# Altium schematic sheet 02_POWERDIAGRAM-WITHOUT_BATTERY.SchDoc: P30L
size A1; Author: Kang jin; Engineer: Kang jin; Organization: 六零加智能科技; Address4: www.nidone.com.cn; Revision: 1.0; SheetNumber: 2; SheetTotal: 23
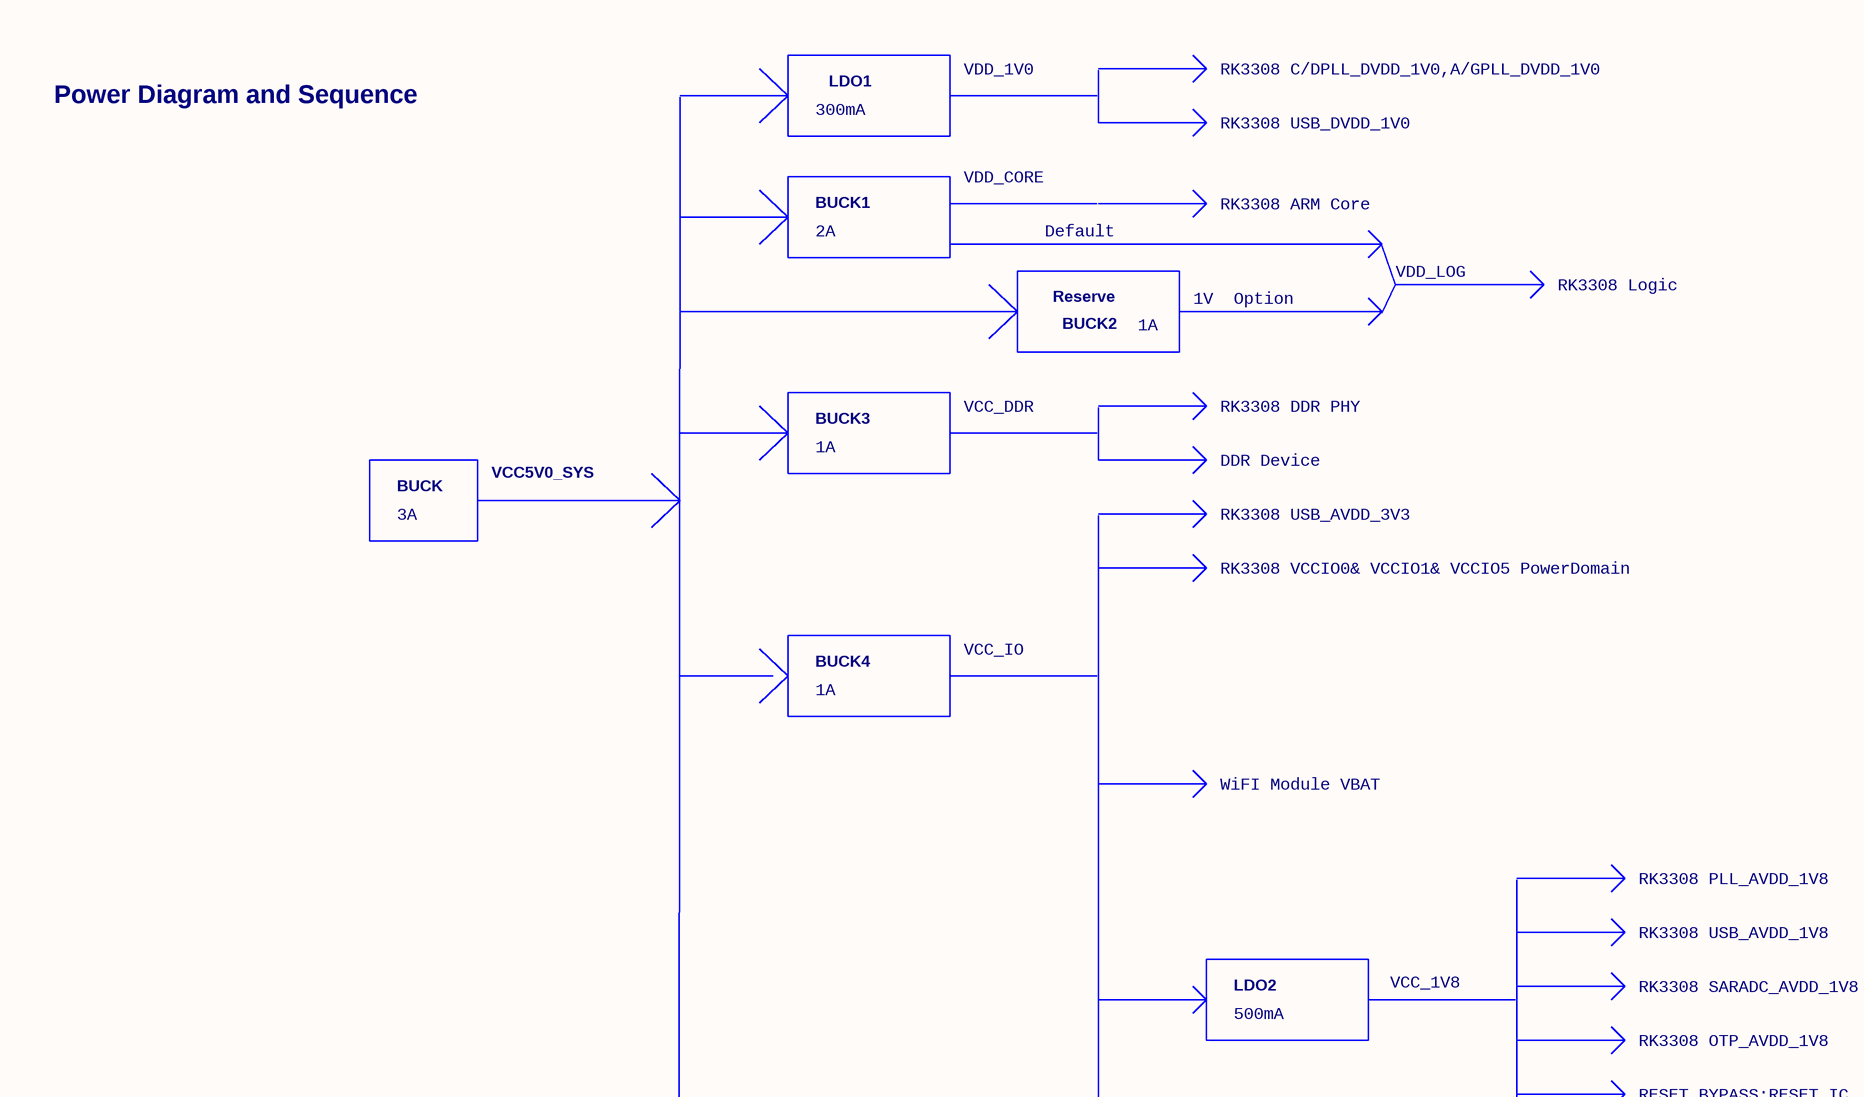
[diagram p0: 02_POWERDIAGRAM-WITHOUT_BATTERY.SchDoc, top left]
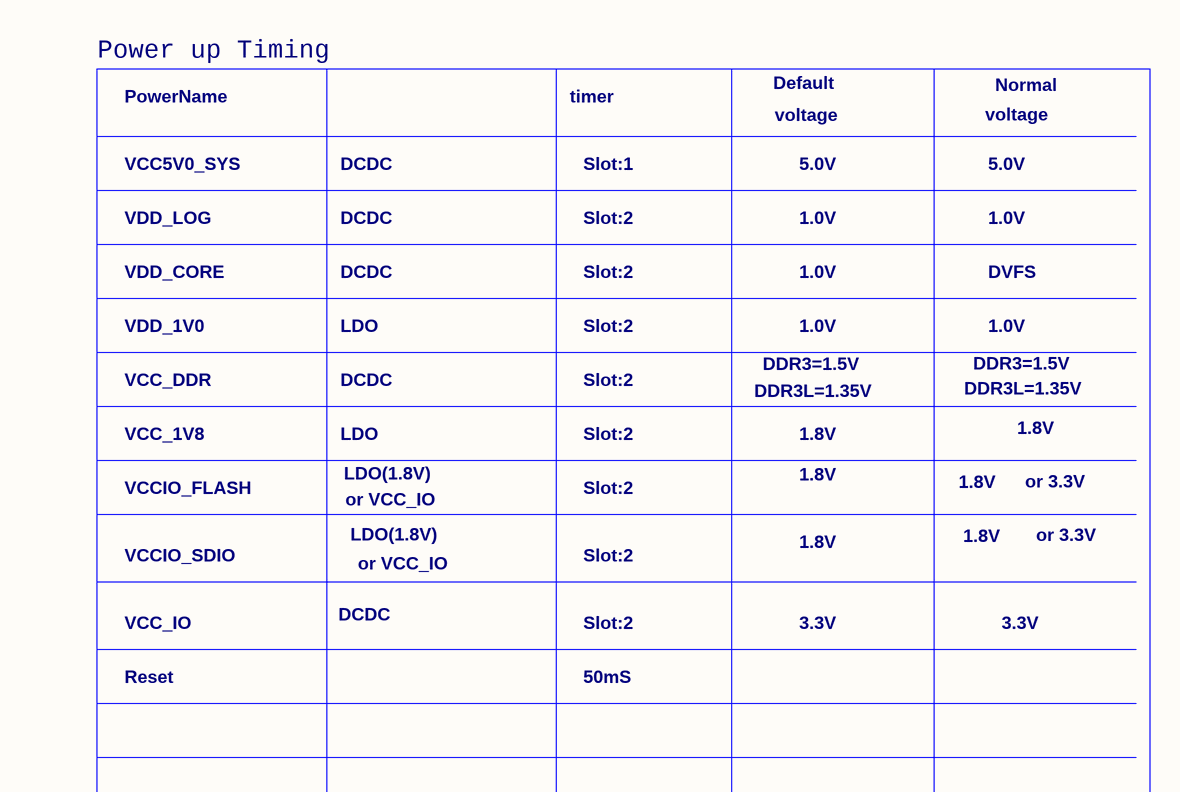
[diagram p1: 02_POWERDIAGRAM-WITHOUT_BATTERY.SchDoc, top right]
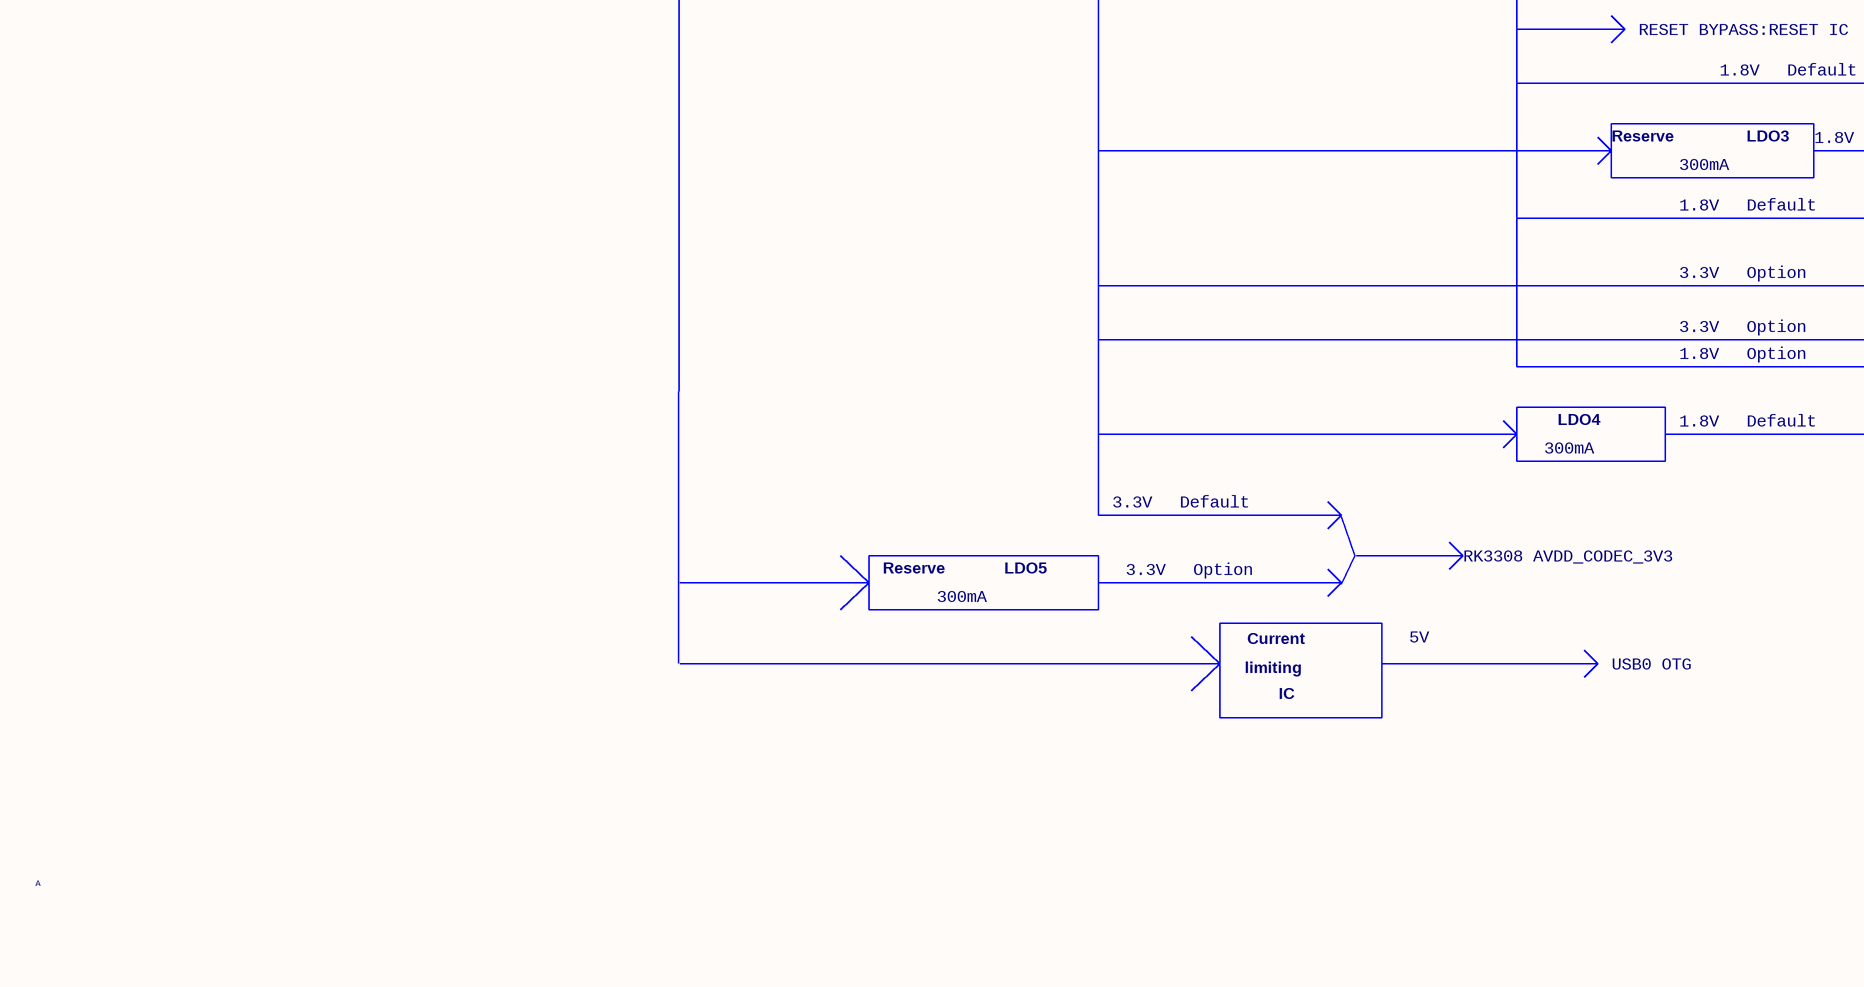
[diagram p2: 02_POWERDIAGRAM-WITHOUT_BATTERY.SchDoc, bottom left]
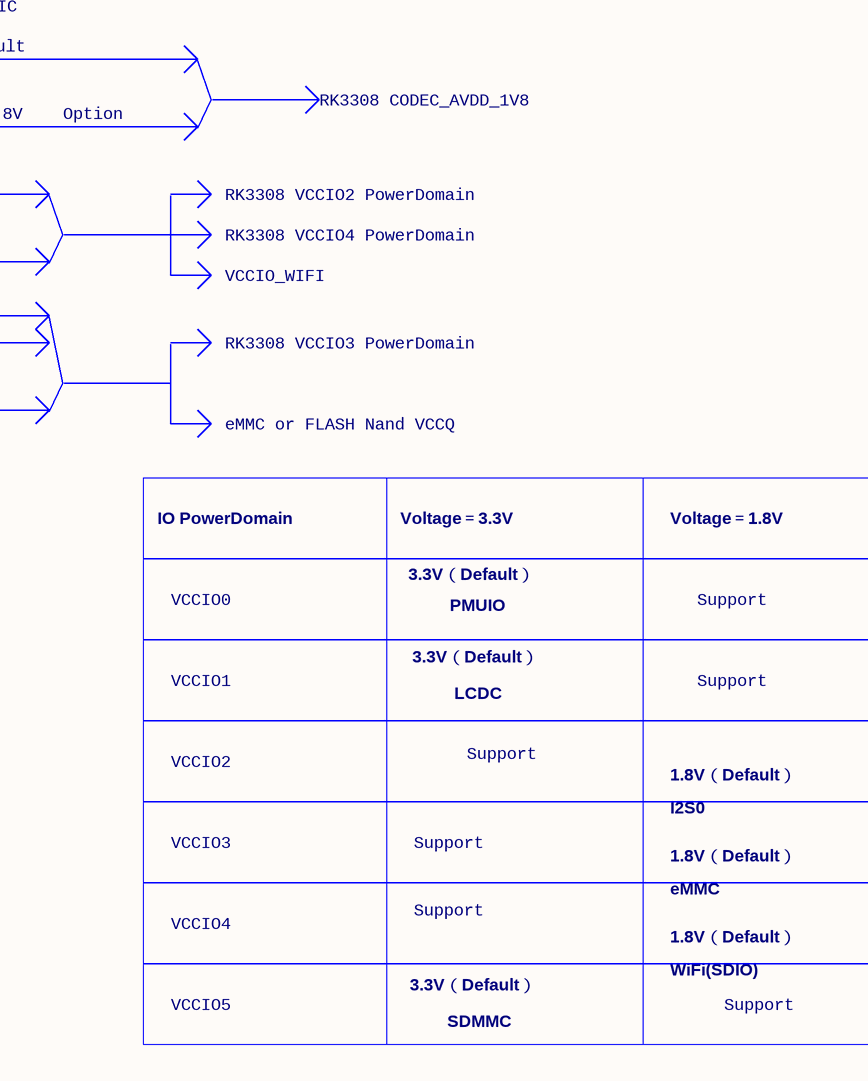
[diagram p3: 02_POWERDIAGRAM-WITHOUT_BATTERY.SchDoc, bottom right]

## Notes on the sheet
- Power Diagram and Sequence
- 300mA
- LDO1
- VDD_1V0
- RK3308 C/DPLL_DVDD_1V0,A/GPLL_DVDD_1V0
- Power up Timing
- PowerName
- timer
- Default
- voltage
- Normal
- VDD_CORE
- RK3308 USB_DVDD_1V0
- VCC5V0_SYS
- DCDC
- Slot:1
- 5.0V
- 2A
- BUCK1
- RK3308 ARM Core
- VDD_LOG
- Slot:2
- 1.0V
- Reserve
- 1V
- Option
- RK3308 Logic
- DVFS
- BUCK2
- 1A
- VCC_DDR
- LDO
- DDR3=1.5V
- DDR3L=1.35V
- BUCK3
- RK3308 DDR PHY
- VCC_1V8
- 1.8V
- 3A
- BUCK
- DDR Device
- RK3308 USB_AVDD_3V3
- VCCIO_FLASH
- LDO(1.8V)
- or VCC_IO
- or 3.3V
- RK3308 VCCIO0& VCCIO1& VCCIO5 PowerDomain
- VCCIO_SDIO
- VCC_IO
- 3.3V
- BUCK4
- Reset
- 50mS
- WiFI Module VBAT
- RK3308 PLL_AVDD_1V8
- LDO2
- RK3308 SARADC_AVDD_1V8
- RK3308 USB_AVDD_1V8
- 500mA
- RK3308 OTP_AVDD_1V8
- RESET BYPASS:RESET IC
- RK3308 CODEC_AVDD_1V8
- LDO3
- RK3308 VCCIO2 PowerDomain
- RK3308 VCCIO4 PowerDomain
- VCCIO_WIFI
- RK3308 VCCIO3 PowerDomain
- LDO4
- eMMC or FLASH Nand VCCQ
- LDO5
- RK3308 AVDD_CODEC_3V3
- IO PowerDomain
- Voltage＝3.3V
- 3.3V（Default）
- Voltage＝1.8V
- limiting
- Current
- 5V
- USB0 OTG
- VCCIO0
- PMUIO
- Support
- IC
- VCCIO1
- LCDC
- VCCIO2
- 1.8V（Default）
- A
- VCCIO3
- I2S0
- eMMC
- VCCIO4
- WiFi(SDIO)
- VCCIO5
- SDMMC
- Title:
- Size:
- Date:
- File:
- A1
- Engineer:
- Time:
- Revision:
- Sheet
- of